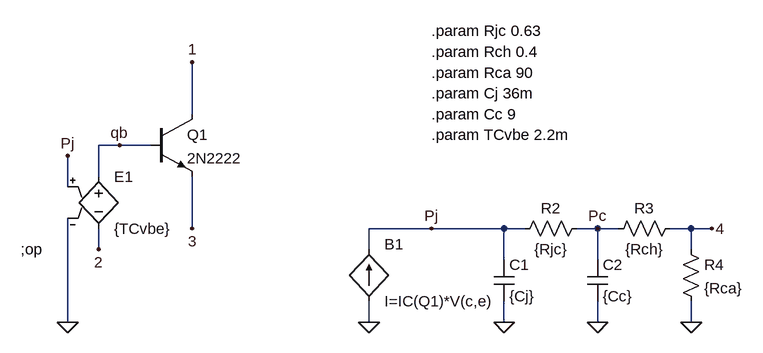
[diagram p0: schematic thermal.asc]
thermal.asc, the LTspice schematic file:
Version 4
SHEET 1 1092 680
WIRE 144 64 144 -16
WIRE 32 112 0 112
WIRE 80 112 32 112
WIRE 0 160 0 112
WIRE -48 176 -48 128
WIRE 144 240 144 160
WIRE 512 240 416 240
WIRE 624 240 512 240
WIRE 656 240 624 240
WIRE 768 240 736 240
WIRE 800 240 768 240
WIRE 912 240 880 240
WIRE 944 240 912 240
WIRE 0 272 0 240
WIRE 416 272 416 240
WIRE 912 272 912 240
WIRE 624 288 624 240
WIRE 768 288 768 240
WIRE -48 384 -48 224
WIRE 416 384 416 352
WIRE 624 384 624 352
WIRE 768 384 768 352
WIRE 912 384 912 352
FLAG 416 384 0
FLAG 512 240 Pj
FLAG 144 -16 1
FLAG 144 240 3
FLAG 624 384 0
FLAG 768 384 0
FLAG 944 240 4
FLAG 912 384 0
FLAG -48 384 0
FLAG -48 128 Pj
FLAG 0 272 2
FLAG 32 112 qb
FLAG 768 240 Pc
SYMBOL npn 80 64 R0
SYMATTR InstName Q1
SYMATTR Value 2N2222
SYMBOL bi 416 352 M180
WINDOW 0 24 88 Left 0
WINDOW 3 24 0 Left 0
SYMATTR InstName B1
SYMATTR Value I=IC(Q1)*V(c,e)
SYMBOL cap 608 288 R0
SYMATTR InstName C1
SYMATTR Value {Cj}
SYMBOL res 752 224 R90
WINDOW 0 0 56 VBottom 0
WINDOW 3 32 56 VTop 0
SYMATTR InstName R2
SYMATTR Value {Rjc}
SYMBOL cap 752 288 R0
SYMATTR InstName C2
SYMATTR Value {Cc}
SYMBOL res 896 224 R90
WINDOW 0 0 56 VBottom 0
WINDOW 3 32 56 VTop 0
SYMATTR InstName R3
SYMATTR Value {Rch}
SYMBOL res 896 256 R0
SYMATTR InstName R4
SYMATTR Value {Rca}
SYMBOL e 0 144 R0
SYMATTR InstName E1
SYMATTR Value {TCvbe}
TEXT -120 272 Left 0 !;op
TEXT 512 -64 Left 0 !.param Rjc 0.63
TEXT 512 -32 Left 0 !.param Rch 0.4
TEXT 512 32 Left 0 !.param Cj 36m
TEXT 512 64 Left 0 !.param Cc 9
TEXT 512 0 Left 0 !.param Rca 90
TEXT 512 96 Left 0 !.param TCvbe 2.2m

The netlist it stands for:
* thermal.asc
Q1 1 qb 3 0 2N2222
B1 0 Pj I=IC(Q1)*V(c,e)
C1 Pj 0 {Cj}
R2 Pc Pj {Rjc}
C2 Pc 0 {Cc}
R3 4 Pc {Rch}
R4 4 0 {Rca}
E1 qb 2 Pj 0 {TCvbe}
.model NPN NPN
.model PNP PNP
.lib standard.bjt
;op
.param Rjc 0.63
.param Rch 0.4
.param Cj 36m
.param Cc 9
.param Rca 90
.param TCvbe 2.2m
.backanno
.end